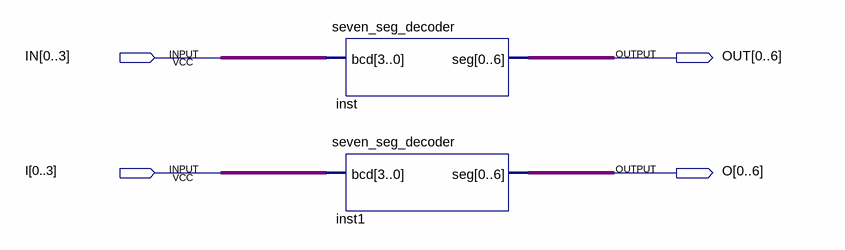
[diagram p0: schematic sheet]
// Quartus schematic lab5step1.bdf as structural Verilog: 2 symbols, 4 pins
module lab5step1 (
  input  [0:3] IN,
  input  [0:3] I,
  output [0:6] OUT,
  output [0:6] O
);

  seven_seg_decoder inst (.bcd(IN), .seg(OUT));
  seven_seg_decoder inst1 (.bcd(I), .seg(O));
endmodule
